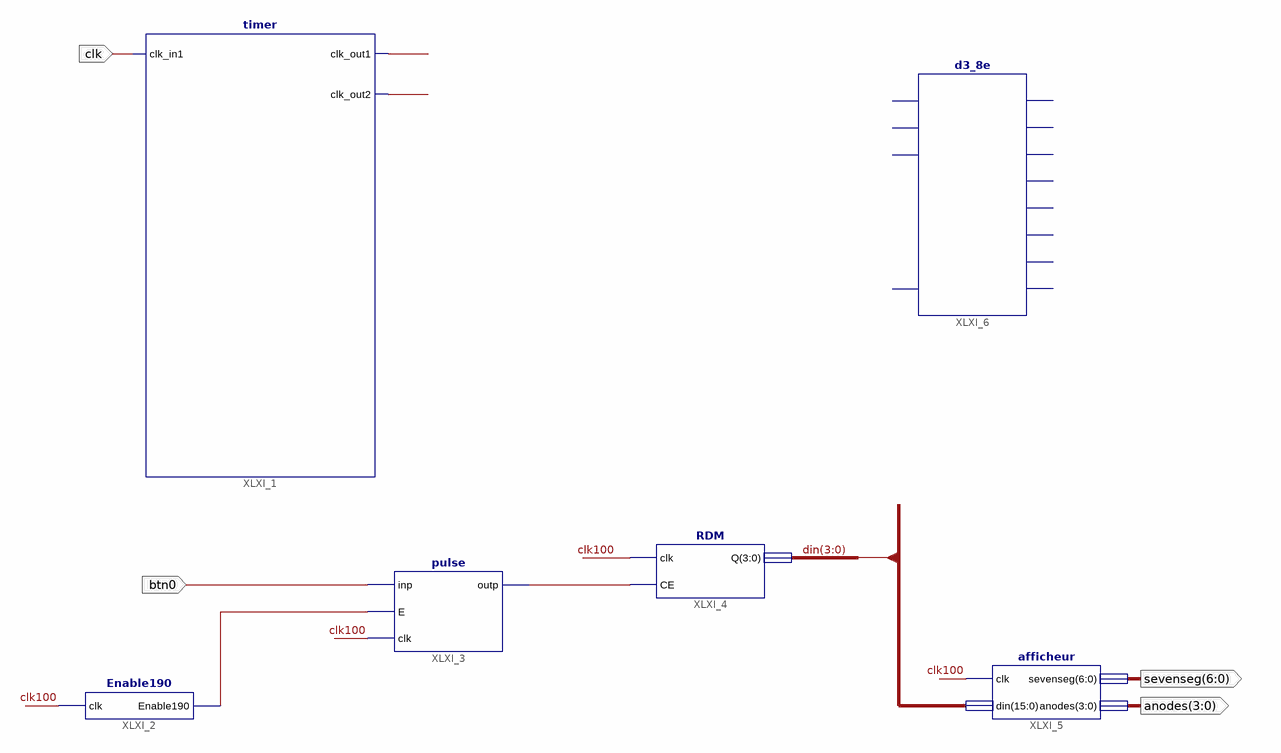
[diagram p0: schematic sheet 1]
// Xilinx ISE schematic toplevel.sch (spartan6) as structural Verilog: 6 symbols, 4 ports
module toplevel (
  input  clk,
  input  btn0,
  output [6:0] sevenseg,
  output [3:0] anodes
);

  wire clk3, clk100, XLXN_7, XLXN_10;
  wire [15:0] din;

  timer XLXI_1 (.clk_in1(clk), .clk_out1(clk100), .clk_out2(clk3));
  Enable190 XLXI_2 (.clk(clk100), .Enable190(XLXN_7));
  pulse XLXI_3 (.inp(btn0), .E(XLXN_7), .clk(clk100), .outp(XLXN_10));
  RDM XLXI_4 (.clk(clk100), .CE(XLXN_10), .Q(din[3:0]));
  afficheur XLXI_5 (.clk(clk100), .din(din), .sevenseg(sevenseg), .anodes(anodes));
  d3_8e XLXI_6 ();  // open: A0, A1, A2, E, D0, D1, D2, D3, D4, D5, D6, D7
endmodule
